# Altium schematic sheet Camera.SchDoc
size A4; SheetNumber: 5; SheetTotal: 15
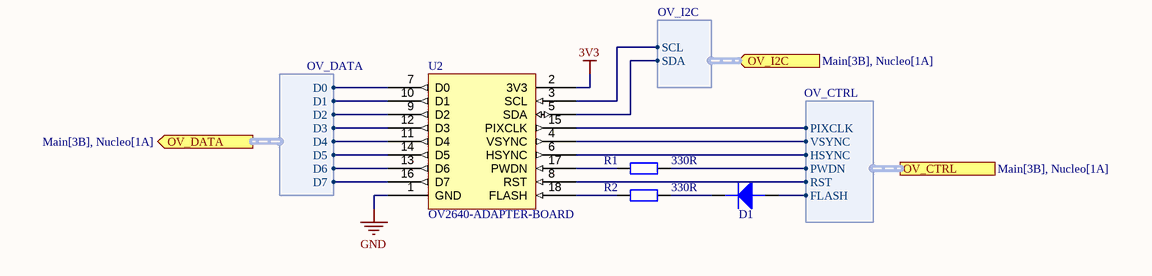
[diagram p0: Camera.SchDoc]

## Parts
D1  Diode  [DIOM4325X24M]  (value not drawn)
R1  330R  [FP_0805_RES]
R2  330R  [FP_0805_RES]
U2  OV2640-ADAPTER-BOARD  [CONNECTOR-18P - 90°]

## Ports
OV_CTRL (harness OV_CTRL, see Main[3B], Nucleo[1A]), OV_DATA (out, harness OV_DATA, see Main[3B], Nucleo[1A]), OV_I2C (in, harness OV_I2C, see Main[3B], Nucleo[1A])

## Harnesses
OV_DATA: D0, D1, D2, D3, D4, D5, D6, D7
OV_I2C: SCL, SDA
OV_CTRL: PIXCLK, VSYNC, HSYNC, RST, PWDN, FLASH

## Nets
3V3: U2.2(3V3)
GND: U2.1(GND)
NetD1_1: D1.1(K) R2.2
NetD1_2: D1.2(A) ; port OV_CTRL.FLASH
NetR1_1: R1.1 U2.17(PWDN)
NetR1_2: R1.2 ; port OV_CTRL.PWDN
NetR2_1: R2.1 U2.18(FLASH)
NetU2_3: U2.3(SCL) ; port OV_I2C.SCL
NetU2_4: U2.4(VSYNC) ; port OV_CTRL.VSYNC
NetU2_5: U2.5(SDA) ; port OV_I2C.SDA
NetU2_6: U2.6(HSYNC) ; port OV_CTRL.HSYNC
NetU2_7: U2.7(D0) ; port OV_DATA.D0
NetU2_8: U2.8(RST) ; port OV_CTRL.RST
NetU2_9: U2.9(D2) ; port OV_DATA.D2
NetU2_10: U2.10(D1) ; port OV_DATA.D1
NetU2_11: U2.11(D4) ; port OV_DATA.D4
NetU2_12: U2.12(D3) ; port OV_DATA.D3
NetU2_13: U2.13(D6) ; port OV_DATA.D6
NetU2_14: U2.14(D5) ; port OV_DATA.D5
NetU2_15: U2.15(PIXCLK) ; port OV_CTRL.PIXCLK
NetU2_16: U2.16(D7) ; port OV_DATA.D7

## Notes on the sheet
- Size
- Date
- A4
- Title
- Sheet number
- Author
- Revision

## Library data of the parts
D1 = Diode: Name: 1A 40V DO-214AC SCH.RECT. SS14 (YET) SMA-W; Supplier: Lomex; Reference: 83-02-47
R1 R2 = RES: Resistor; Name: 330R 0805 5% CR-05JL7--330R 0.125W (VIK); Supplier: Lomex; Reference: 81-10-81; Value: 330R
U2 = OV2640-ADAPTER-BOARD: Adapter board for OV2640 camera modul; Name: ZL231-18KG; Reference: 100.480.07; Supplier: hestore